# Altium schematic sheet LED_CONTROLLER.SchDoc
size A4
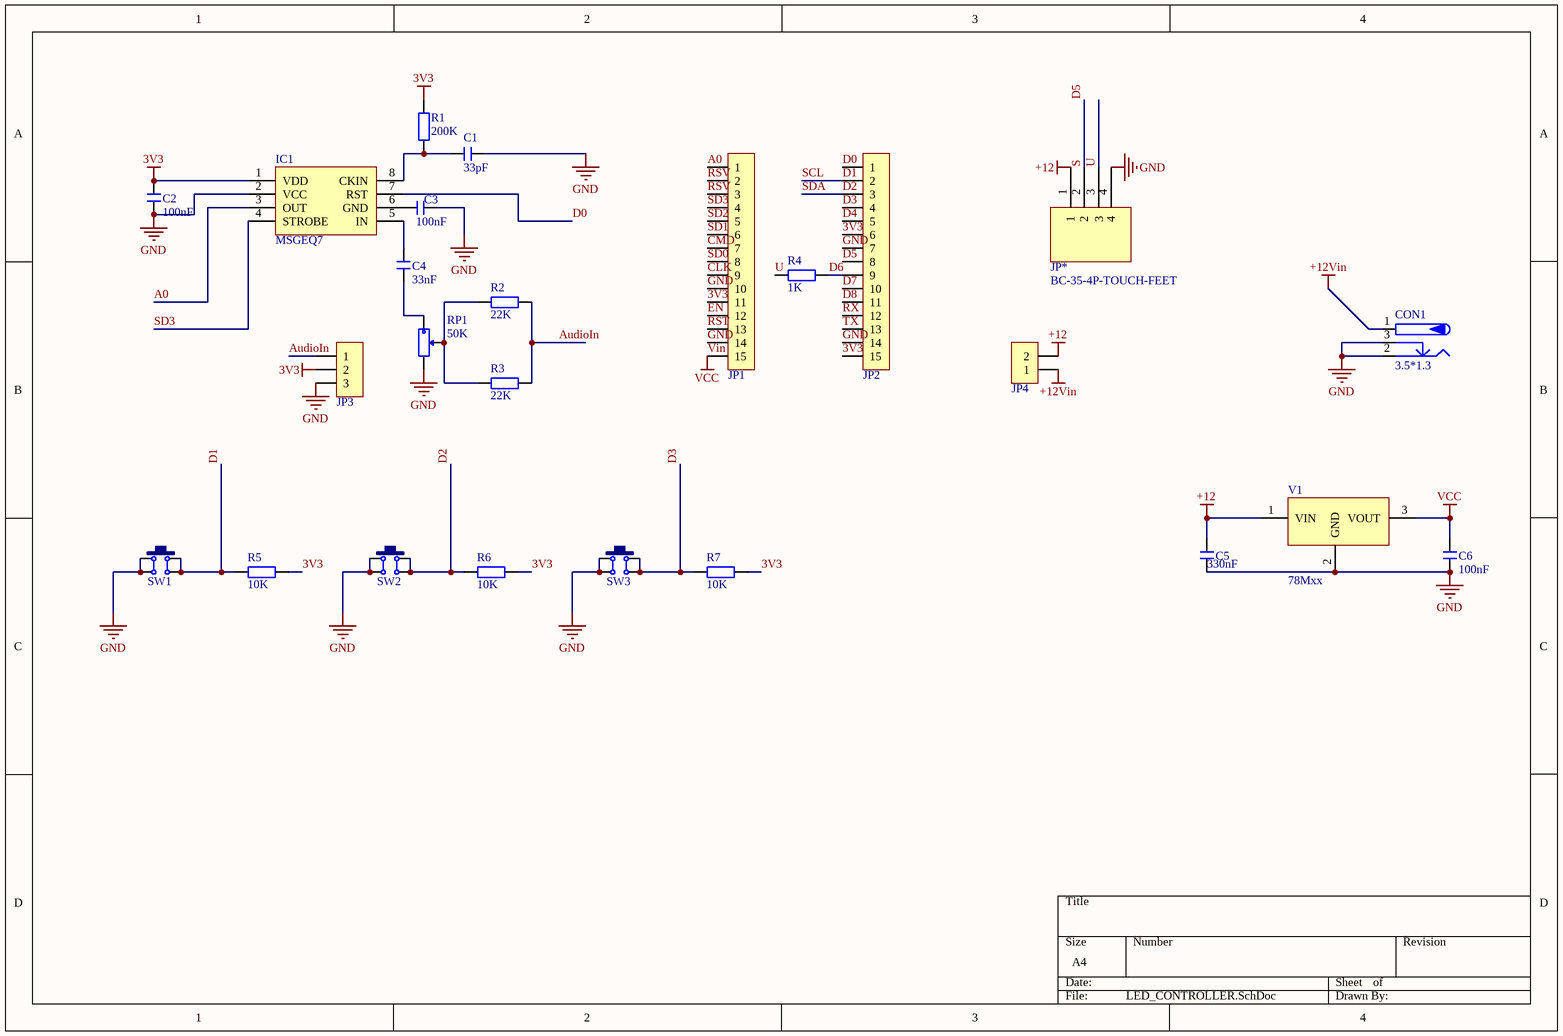
[diagram p0: LED_CONTROLLER.SchDoc]

## Parts
C1  33pF  [C 0603_L]
C2  100nF  [C 0603_L]
C3  100nF  [C 0603_L]
C4  33nF  [C 0603_L]
C5  330nF  [C 0603_L]
C6  100nF  [C 0603_L]
CON1  3.5*1.3  [DC-050]
IC1  MSGEQ7  [DIP8-300]
JP1  HDR-1X15  [HDR2.54-M-LI-15P]  (value not drawn)
JP2  HDR-1X15  [HDR2.54-M-LI-15P]  (value not drawn)
JP3  HDR-1X3  [HDR2.54-M-LI-3P]  (value not drawn)
JP4  HDR-1X2  [KF128-3.81-2P]  (value not drawn)
JP*  BC-35-4P-TOUCH-FEET  [BC-35-4P-TOUCH-FEET]
R1  200K  [R 0603_L]
R2  22K  [R 0603_L]
R3  22K  [R 0603_L]
R4  1K  [R 0603_L]
R5  10K  [R 0603_L]
R6  10K  [R 0603_L]
R7  10K  [R 0603_L]
RP1  50K  [3362P]
SW1  6x6x5  [TSW SMD-6*6*15]  (value not drawn)
SW2  6x6x5  [TSW SMD-6*6*15]  (value not drawn)
SW3  6x6x5  [TSW SMD-6*6*15]  (value not drawn)
V1  78Mxx  [TO252]

## Nets
3V3: C2.2 IC1.1(VDD) JP1.11 JP2.6 JP2.15 JP3.2 R1.2 R5.2 R6.2 R7.2
+12: C5.1 JP4.2 JP*.1 V1.1(VIN)
+12Vin: CON1.1 JP4.1
GND: C1.1 C2.1 C3.1 C5.2 C6.1 CON1.2 CON1.3 IC1.2(VCC) JP1.10 JP1.14 JP2.7 JP2.14 JP3.3 JP*.4 RP1.3 SW1.1 SW1.4 SW2.1 SW2.4 SW3.1 SW3.4 V1.2(GND)
Vin: C6.2 JP1.15 V1.3(VOUT)  [also labelled VCC]
A0: IC1.3(OUT) JP1.1
AudioIn: JP3.1 R2.2 R3.2
CLK: JP1.9
CMD: JP1.7
D0: IC1.7(RST) JP2.1
D1: JP2.2 R5.1 SW1.2 SW1.3  [also labelled SCL]
D2: JP2.3 R6.1 SW2.2 SW2.3  [also labelled SDA]
D3: JP2.4 R7.1 SW3.2 SW3.3
D4: JP2.5
D5: JP2.8 JP*.2  [also labelled S]
D6: JP2.9 R4.1
D7: JP2.10
D8: JP2.11
EN: JP1.12
RST: JP1.13
RSV: JP1.2 JP1.3
RX: JP2.12
SD0: JP1.8
SD1: JP1.6
SD2: JP1.5
SD3: IC1.4(STROBE) JP1.4
TX: JP2.13
U: JP*.3 R4.2
NetC1_2: C1.2 IC1.8(CKIN) R1.1
NetC3_2: C3.2 IC1.6(GND)
NetC4_1: C4.1 RP1.1
NetC4_2: C4.2 IC1.5(IN)
NetR2_1: R2.1 R3.1 RP1.2

## Library data of the parts
C1-C6 = C: 无极性贴片电容; 版权归属: 源创客; 材质: X7R; BOM名称: 无极性贴片电容; 学习资源: www.ooocke.com
CON1 = P-DC: 低压电源接口; BOM名称: DC电源接口; 版权归属: 源创客; 学习资源: www.ooocke.com
IC1 = MSGEQ7: 版权归属: 源创客; 学习资源: www.ooocke.com
JP1 JP2 = Header 15: 15P接插件; 版权归属: 源创客; BOM名称: 15P接插件; 学习资源: www.ooocke.com
JP3 = Header 3: 3P接插件; 版权归属: 源创客; BOM名称: 3P接插件; 学习资源: www.ooocke.com
JP4 = Header 2: 2P接插件; 版权归属: 源创客; BOM名称: 2P接插件; 学习资源: www.ooocke.com
R1-R7 = R: 贴片电阻; 版权归属: 源创客; BOM名称: 贴片电阻; 学习资源: www.ooocke.com
RP1 = RP-ID: 插件单联电位器; BOM名称: 插件电位器; 版权归属: 源创客; 学习资源: www.ooocke.com
SW1-SW3 = TSW SMD-6x6: 贴片6x6轻触开关; 版权归属: 源创客; BOM名称: 贴片6x6轻触开关; 学习资源: www.ooocke.com
V1 = 78Mxx: 线性稳压芯片; 版权归属: 源创客; BOM名称: 线性稳压芯片; 学习资源: www.ooocke.com